# Altium schematic sheet 3_INTERFACE_DOS_DRIVERS.SchDoc
size Tabloid; SheetNumber: 3; SheetTotal: 5; SPICEModelCacheFCVACYYO: <root> / <DocumentId>FCVACYYO</DocumentId> / </root>
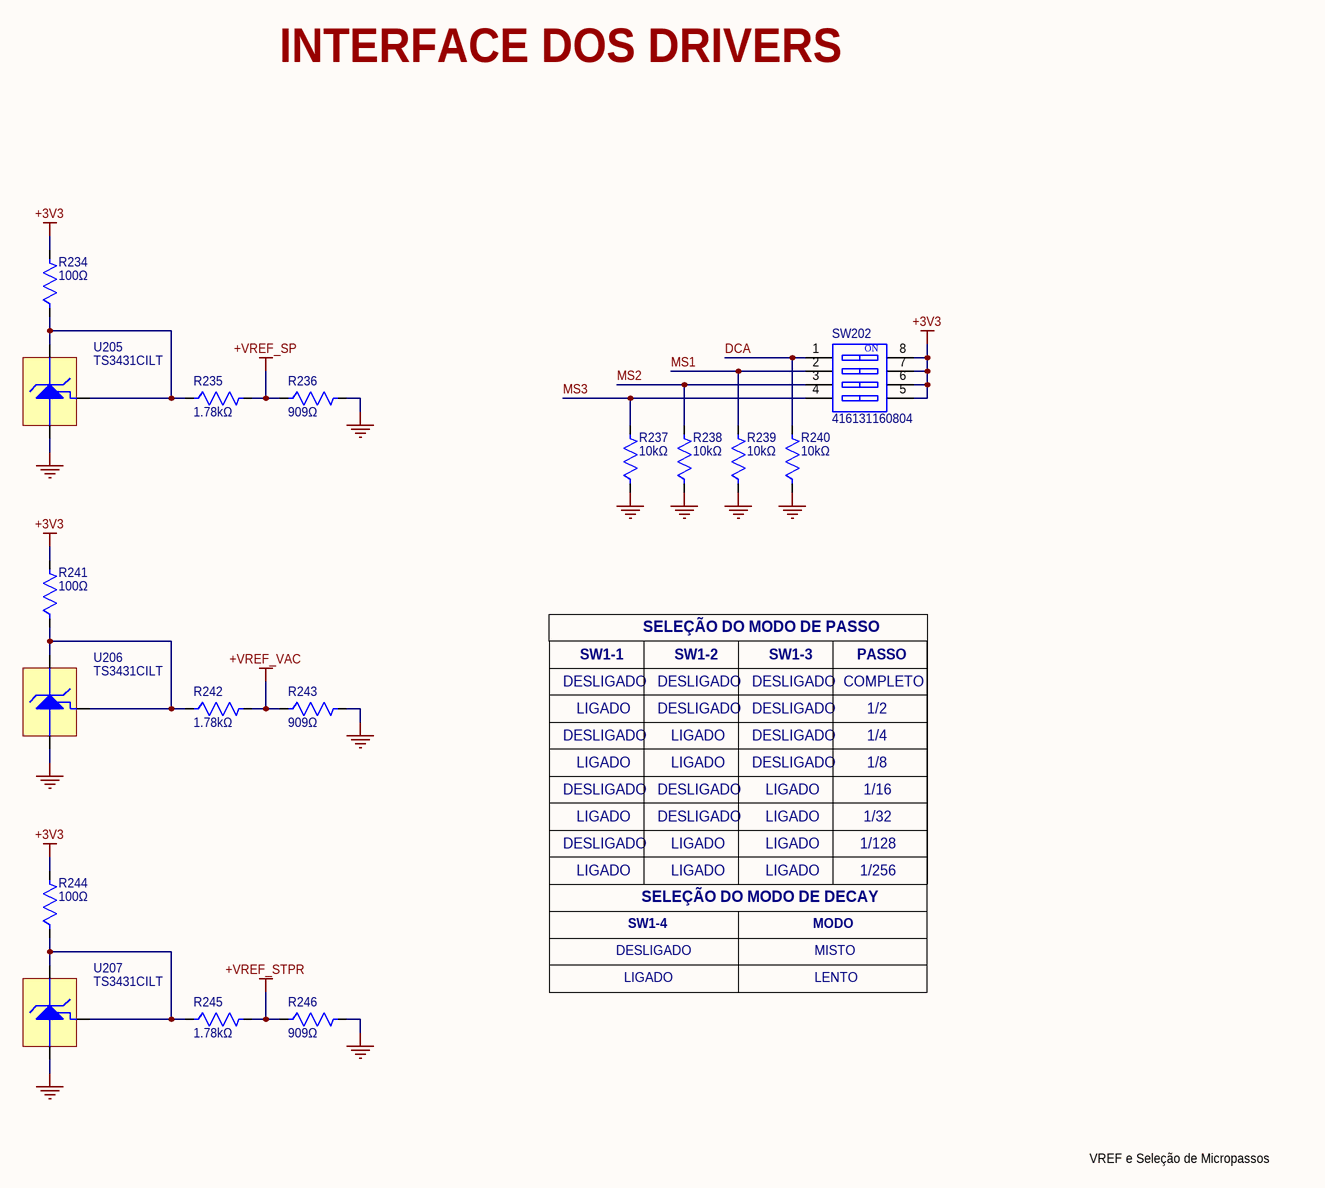
[diagram p0: 3_INTERFACE_DOS_DRIVERS.SchDoc]

## Parts
R234  100Ω  [0603-WAVE]
R235  1.78kΩ  [0603-WAVE]
R236  909Ω  [0603-WAVE]
R237  10kΩ  [0603-WAVE]
R238  10kΩ  [0603-WAVE]
R239  10kΩ  [0603-WAVE]
R240  10kΩ  [0603-WAVE]
R241  100Ω  [0603-WAVE]
R242  1.78kΩ  [0603-WAVE]
R243  909Ω  [0603-WAVE]
R244  100Ω  [0603-WAVE]
R245  1.78kΩ  [0603-WAVE]
R246  909Ω  [0603-WAVE]
SW202  416131160804  [416131160804]
U205  TS3431CILT  [SOT-23-3]
U206  TS3431CILT  [SOT-23-3]
U207  TS3431CILT  [SOT-23-3]

## Nets
+3V3: R234.2 R241.2 R244.2 SW202.5 SW202.6 SW202.7 SW202.8
+VREF_SP: R235.2 R236.1
+VREF_STPR: R245.2 R246.1
+VREF_VAC: R242.2 R243.1
GND: R236.2 R237.1 R238.1 R239.1 R240.1 R243.2 R246.2 U205.3(ANODE) U206.3(ANODE) U207.3(ANODE)
DCA: R240.2 SW202.1
MS1: R239.2 SW202.2
MS2: R238.2 SW202.3
MS3: R237.2 SW202.4
NetR234_1: R234.1 R235.1 U205.1(REF) U205.2(CATHODE)
NetR241_1: R241.1 R242.1 U206.1(REF) U206.2(CATHODE)
NetR244_1: R244.1 R245.1 U207.1(REF) U207.2(CATHODE)

## Notes on the sheet
- INTERFACE DOS DRIVERS
- SW1-1
- SELEÇÃO DO MODO DE PASSO
- SW1-2
- SW1-3
- PASSO
- DESLIGADO
- LIGADO
- COMPLETO
- 1/2
- 1/4
- 1/16
- 1/8
- 1/128
- 1/256
- 1/32
- SW1-4
- SELEÇÃO DO MODO DE DECAY
- MODO
- LENTO
- MISTO
- VREF e Seleção de Micropassos
- Title:
- Size:
- Tabloid
- Number:
- Sheet of:
- Revision:
- Date:
- Project Name:
- Drawn By:
- (in symbol 416131160804) ON

## Library data of the parts
R234 R241 R244 = RC0603FR-07100RL: RES 100 OHM 1% 1/10W 0603; Manufacturer: Yageo Group; Max Power Dissipation: 100mW; Temperature Coefficient: ±200ppm/°C; Voltage Rating (AC): 50V; Voltage Rating: 75V; Supplier Part Number: 311-100HRCT-ND; Manufacturer Part Number: RC0603FR-07100RL; Value: 100Ω; Case Code (Imperial): 0603; Case Code (Metric): 1608; Case/Package: 0603; Category: Chip SMD Resistors; China RoHS: Non-Compliant; Composition: Thick Film; Contact Plating: Tin; Depth: 800µm; Features: Moisture Resistant; Height: 450µm; Lead Free: Lead Free; Length: 1.6mm; Lifecycle Status: Production; Max Operating Temperature: 155°C; Military Standard: Not; Min Operating Temperature: -55°C; Mounting Technology: Surface Mount; Number of Terminals: 2; Number of Terminations: 2; Packaging: Tape & Reel; Power Dissipation: 100mW; Power Rating: 100mW; Radiation Hardening: No; REACH SVHC: Yes; RoHS: Compliant; Supplier: DigiKey; Termination: SMD/SMT; Tolerance: 1%; Component Link Description: https://www.yageogroup.com/content/datasheet/asset/file/PYU-RC_GROUP_51_ROHS_L; Component Link URL: https://www.yageogroup.com/content/datasheet/asset/file/PYU-RC_GROUP_51_ROHS_L; Datasheet: https://www.yageogroup.com/content/datasheet/asset/file/PYU-RC_GROUP_51_ROHS_L; Voltage Rating (DC): 50V; Weight: 2.012816mg; Width: 800µm; Working Voltage: 75V
R235 R242 R245 = RC0603FR-071K78L: RES 1.78K OHM 1% 1/10W 0603; Manufacturer: Yageo Group; Max Power Dissipation: 100mW; Temperature Coefficient: ±200ppm/°C; Voltage Rating (AC): 50V; Voltage Rating: 75V; Supplier Part Number: 311-1.78KHRCT-ND; Manufacturer Part Number: RC0603FR-071K78L; Value: 1.78kΩ; Case Code (Imperial): 0603; Case Code (Metric): 1608; Case/Package: 0603; Category: Chip SMD Resistors; China RoHS: Non-Compliant; Composition: Thick Film; Contact Plating: Tin; Depth: 800µm; Features: Moisture Resistant; Height: 450µm; Lead Free: Lead Free; Length: 1.6mm; Lifecycle Status: Production; Max Operating Temperature: 155°C; Military Standard: Not; Min Operating Temperature: -55°C; Mounting Technology: Surface Mount; Number of Terminals: 2; Number of Terminations: 2; Packaging: Tape & Reel; Power Dissipation: 100mW; Power Rating: 100mW; Radiation Hardening: No; REACH SVHC: Yes; RoHS: Compliant; Supplier: DigiKey; Termination: SMD/SMT; Tolerance: 1%; Component Link Description: https://www.yageogroup.com/content/datasheet/asset/file/PYU-RC_GROUP_51_ROHS_L; Component Link URL: https://www.yageogroup.com/content/datasheet/asset/file/PYU-RC_GROUP_51_ROHS_L; Datasheet: https://www.yageogroup.com/content/datasheet/asset/file/PYU-RC_GROUP_51_ROHS_L; Voltage Rating (DC): 50V; Weight: 2.012816mg; Width: 800µm; Working Voltage: 75V
R236 R243 R246 = RC0603FR-07909RL: RES 909 OHM 1% 1/10W 0603; Manufacturer: Yageo Group; Max Power Dissipation: 100mW; Temperature Coefficient: ±200ppm/°C; Voltage Rating (AC): 50V; Voltage Rating: 75V; Supplier Part Number: 311-909HRCT-ND; Manufacturer Part Number: RC0603FR-07909RL; Value: 909Ω; Case Code (Imperial): 0603; Case Code (Metric): 1608; Case/Package: 0603; Category: Chip SMD Resistors; China RoHS: Non-Compliant; Composition: Thick Film; Contact Plating: Tin; Depth: 800µm; Features: Moisture Resistant; Height: 450µm; Lead Free: Lead Free; Length: 1.6mm; Lifecycle Status: Production; Max Operating Temperature: 155°C; Military Standard: Not; Min Operating Temperature: -55°C; Mounting Technology: Surface Mount; Number of Terminals: 2; Number of Terminations: 2; Packaging: Tape & Reel; Power Dissipation: 100mW; Power Rating: 100mW; Radiation Hardening: No; REACH SVHC: Yes; RoHS: Compliant; Supplier: DigiKey; Termination: SMD/SMT; Tolerance: 1%; Component Link Description: https://www.yageogroup.com/content/datasheet/asset/file/PYU-RC_GROUP_51_ROHS_L; Component Link URL: https://www.yageogroup.com/content/datasheet/asset/file/PYU-RC_GROUP_51_ROHS_L; Datasheet: https://www.yageogroup.com/content/datasheet/asset/file/PYU-RC_GROUP_51_ROHS_L; Voltage Rating (DC): 50V; Weight: 2.012816mg; Width: 800µm; Working Voltage: 75V
R237-R240 = RC0603FR-0710KL: RES 10K OHM 1% 1/10W 0603; Manufacturer: Yageo Group; Max Power Dissipation: 100mW; Temperature Coefficient: ±200ppm/°C; Voltage Rating (AC): 50V; Voltage Rating: 75V; Supplier Part Number: 311-10.0KHRCT-ND; Manufacturer Part Number: RC0603FR-0710KL; Value: 10kΩ; Case Code (Imperial): 0603; Case Code (Metric): 1608; Case/Package: 0603; Category: Chip SMD Resistors; China RoHS: Non-Compliant; Composition: Thick Film; Contact Plating: Tin; Depth: 800µm; Features: Moisture Resistant; Height: 450µm; Lead Free: Lead Free; Length: 1.6mm; Lifecycle Status: Production; Max Operating Temperature: 155°C; Military Standard: Not; Min Operating Temperature: -55°C; Mounting Technology: Surface Mount; Number of Terminals: 2; Number of Terminations: 2; Packaging: Tape & Reel; Power Dissipation: 100mW; Power Rating: 100mW; Radiation Hardening: No; REACH SVHC: Yes; RoHS: Compliant; Supplier: DigiKey; Termination: SMD/SMT; Tolerance: 1%; Component Link Description: https://www.yageogroup.com/content/datasheet/asset/file/PYU-RC_GROUP_51_ROHS_L; Component Link URL: https://www.yageogroup.com/content/datasheet/asset/file/PYU-RC_GROUP_51_ROHS_L; Datasheet: https://www.yageogroup.com/content/datasheet/asset/file/PYU-RC_GROUP_51_ROHS_L; Voltage Rating (DC): 50V; Weight: 2.012816mg; Width: 800µm; Working Voltage: 75V
SW202 = 416131160804: WS-DISV Small Compact SMD Dip Switch, Flat Actuator with Top Tape, pitch 1.27mm, 4p; Manufacturer: Wurth Elektronik; Actuator Type: Flat Type; Operation Force: 500g; Number of Poles: 4; Rated Current Non-Switching: 100mA; Rated Current Switching: 25mA; Rated Voltage Non-Switching: 50VDC; Rated Voltage Switching: 24VDC; Manufacturer Part Number: 416131160804; Category: Dip Switches; Match Code: WS-DISV; ComponentLink1Description: Website Link; ComponentLink1URL: https://www.we-online.com/redexpert/article/416131160804?ad; ComponentLink2Description: Datasheet Link; ComponentLink2URL: https://www.we-online.com/redexpert/spec/416131160804?ad; Mount: Surface Mount; Operating Temperature Min: -40degC; Operating Temperature Max: 85degC; Packaging: Tape and Reel; Contact Material: Copper Alloy; Contact Plating: Gold; Pitch: 1.27mm
U205-U207 = TS3431CILT: IC VREF SHUNT ADJ 0.25% SOT23-3; Manufacturer: STMicroelectronics; Cathode Current: 400µA; Max Supply Voltage: 25V; Max Output current: 100mA; Max Output Voltage: 1.243V; Min Output Voltage: 1.237V; Min Supply Voltage: 1.24V; Number of Channels: 1; Output Voltage: 24V; Reference Type: Adjustable, Shunt; Temperature Coefficient: 100ppm/°C; Supplier: DigiKey; Supplier Part Number: 497-4637-1-ND; Manufacturer Part Number: TS3431CILT; RoHS: Compliant; Category: Voltage References; Stock: 16066; Pricing: 1=0.62, 10=0.44, 25=0.3944, 100=0.3441, 250=0.32016, 500=0.30574, 1000=0.29386 (USD); Case/Package: SOT-23; China RoHS: Compliant; Height: 1.02mm; Height - Seated (Max): 1.12mm; Lead Free: Lead Free; Length: 2.9mm; Lifecycle Status: Production; Max Operating Temperature: 125°C; Min Operating Temperature: -40°C; Mounting Technology: Surface Mount; Nominal Supply Voltage: 1.24V; Nominal Output Voltage: 1.24V; Nominal Supply Current: 400µA; Number of Circuits: 1; Number of Outputs: 1; Pins: 3; Number of Terminals: 3; Output Current: 100mA; Packaging: Tape and Reel; Radiation Hardening: No; REACH SVHC: Yes; Reference Voltage: 1.24V; Schedule B: 8542390000, 8542390000|8542390000|8542390000|8542390000|8542390000; Terminal Pitch: 950µm; Termination: SMD/SMT; Tolerance: 0.25%; Width: 1.3mm; ComponentLink1URL: https://datasheet.octopart.com:443/TS3431CILT-STMicroelectronics-datasheet-12523092.pdf?src-supplier=SHENGYU+ELECTRONICS; ComponentLink1Description: https://datasheet.octopart.com:443/TS3431CILT-STMicroelectronics-datasheet-12523092.pdf?src-supplier=SHENGYU+ELECTRONICS; ComponentLink2URL: https://datasheet.octopart.com:443/TS3431CILT-STMicroelectronics-datasheet-10408717.pdf?src-supplier=Upverter; ComponentLink2Description: https://datasheet.octopart.com:443/TS3431CILT-STMicroelectronics-datasheet-10408717.pdf?src-supplier=Upverter; ComponentLink3URL: https://datasheet.octopart.com:443/TS3431CILT-STMicroelectronics-datasheet-124172.pdf?src-supplier=Farnell; ComponentLink3Description: https://datasheet.octopart.com:443/TS3431CILT-STMicroelectronics-datasheet-124172.pdf?src-supplier=Farnell; ComponentLink4URL: https://datasheet.octopart.com:443/TS3431CILT-STMicroelectronics-datasheet-140368796.pdf?src-supplier=TME; ComponentLink4Description: https://datasheet.octopart.com:443/TS3431CILT-STMicroelectronics-datasheet-140368796.pdf?src-supplier=TME; ComponentLink5URL: https://datasheet.octopart.com:443/TS3431CILT-STMicroelectronics-datasheet-18487.pdf?src-supplier=DigiKey; ComponentLink5Description: https://datasheet.octopart.com:443/TS3431CILT-STMicroelectronics-datasheet-18487.pdf?src-supplier=DigiKey